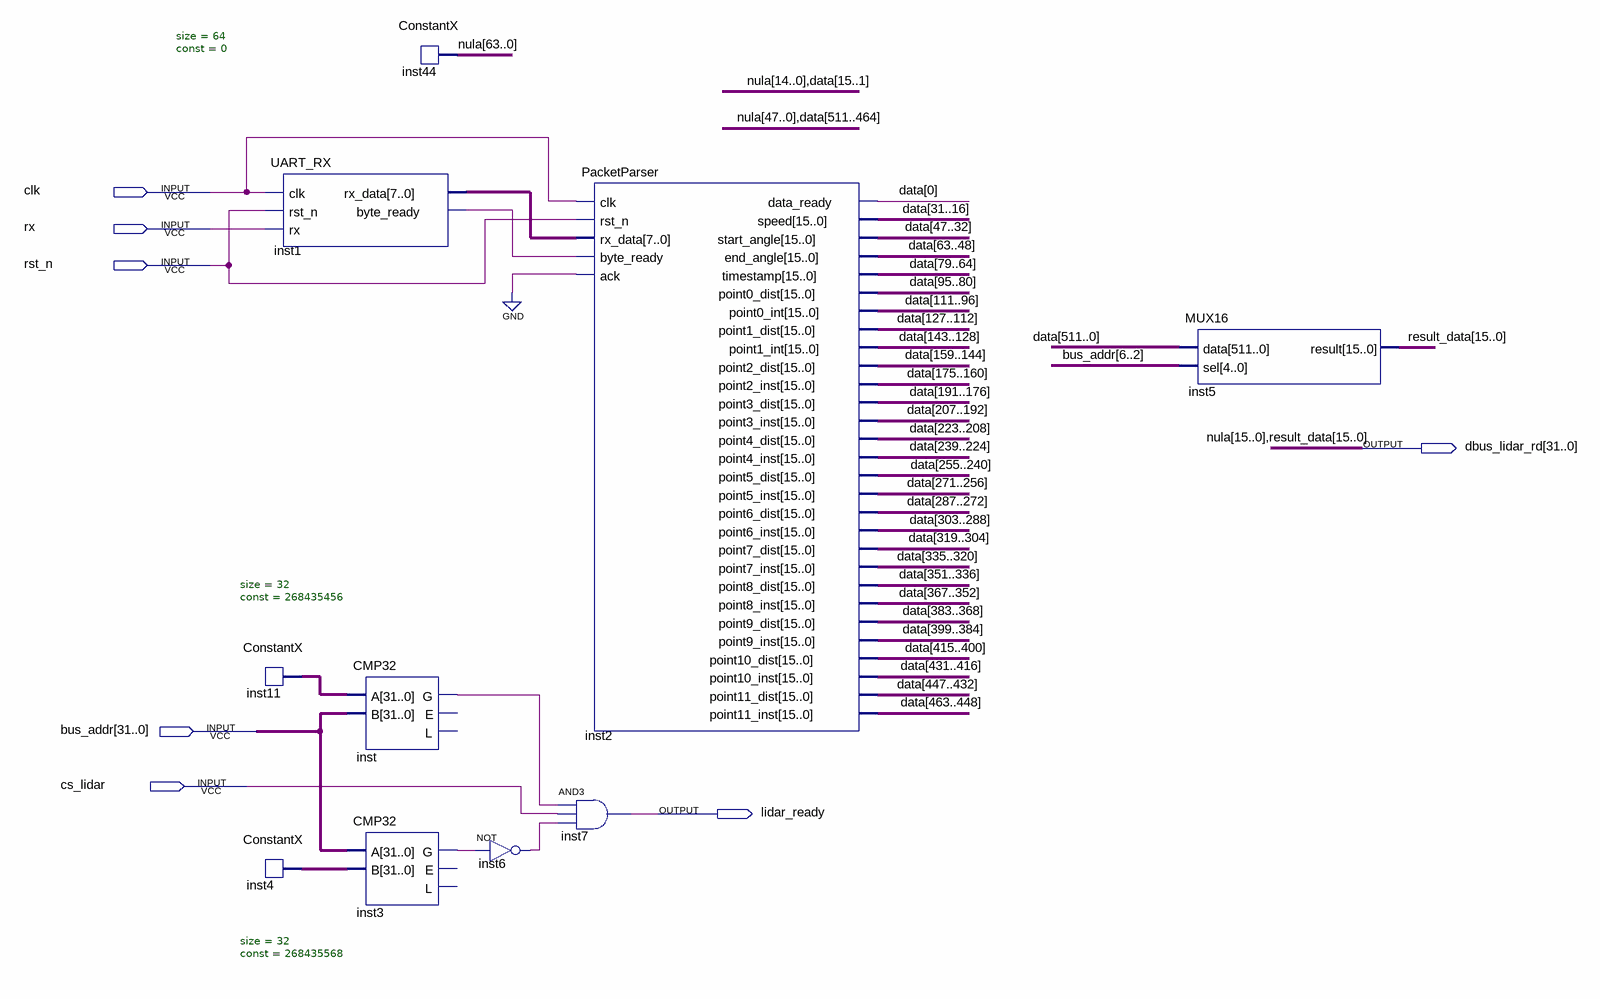
[diagram p0: schematic sheet]
// Quartus schematic LidarBusInterface.bdf as structural Verilog: 10 symbols, 7 pins
module LidarBusInterface (
  input  clk,
  input  rx,
  input  rst_n,
  input  [31:0] bus_addr,
  input  cs_lidar,
  output [31:0] dbus_lidar_rd,
  output lidar_ready
);

  wire inst1_byte_ready, inst3_g, inst6_out, inst_g;
  wire [7:0] inst1_rx_data;
  wire [31:0] inst4_data_out, inst11_data_out;
  wire [63:16] nula;
  wire [511:0] data;

  UART_RX inst1 (.clk(clk), .rst_n(rst_n), .rx(rx), .rx_data(inst1_rx_data), .byte_ready(inst1_byte_ready));
  ConstantX #(.size(32), .\const (268435456)) inst11 (.DATA_OUT(inst11_data_out));
  ConstantX #(.size(32), .\const (268435568)) inst4 (.DATA_OUT(inst4_data_out));
  ConstantX #(.size(64), .\const (0)) inst44 (.DATA_OUT({nula, dbus_lidar_rd[31:16]}));
  CMP32 inst (.A(inst11_data_out), .B(bus_addr), .G(inst_g));  // open: E, L
  CMP32 inst3 (.A(bus_addr), .B(inst4_data_out), .G(inst3_g));  // open: E, L
  not inst6 (inst6_out, inst3_g);
  and inst7 (lidar_ready, inst_g, cs_lidar, inst6_out);
  PacketParser inst2 (
    .clk(clk), .rst_n(rst_n), .rx_data(inst1_rx_data), .byte_ready(inst1_byte_ready), .ack(1'b0),
    .data_ready(data[0]), .speed(data[31:16]), .start_angle(data[47:32]), .end_angle(data[63:48]),
    .timestamp(data[79:64]), .point0_dist(data[95:80]), .point0_int(data[111:96]),
    .point1_dist(data[127:112]), .point1_int(data[143:128]), .point2_dist(data[159:144]),
    .point2_inst(data[175:160]), .point3_dist(data[191:176]), .point3_inst(data[207:192]),
    .point4_dist(data[223:208]), .point4_inst(data[239:224]), .point5_dist(data[255:240]),
    .point5_inst(data[271:256]), .point6_dist(data[287:272]), .point6_inst(data[303:288]),
    .point7_dist(data[319:304]), .point7_inst(data[335:320]), .point8_dist(data[351:336]),
    .point8_inst(data[367:352]), .point9_dist(data[383:368]), .point9_inst(data[399:384]),
    .point10_dist(data[415:400]), .point10_inst(data[431:416]), .point11_dist(data[447:432]),
    .point11_inst(data[463:448]));
  MUX16 inst5 (.data(data), .sel(bus_addr[6:2]), .result(dbus_lidar_rd[15:0]));

  // Other names for the same wires on the sheet: nula[15:0] = dbus_lidar_rd[31:16];
  //   result_data[15:0] = dbus_lidar_rd[15:0]
endmodule
